# Altium schematic sheet benchtopv2.SchDoc
size A; SheetNumber: 2; SheetTotal: 2
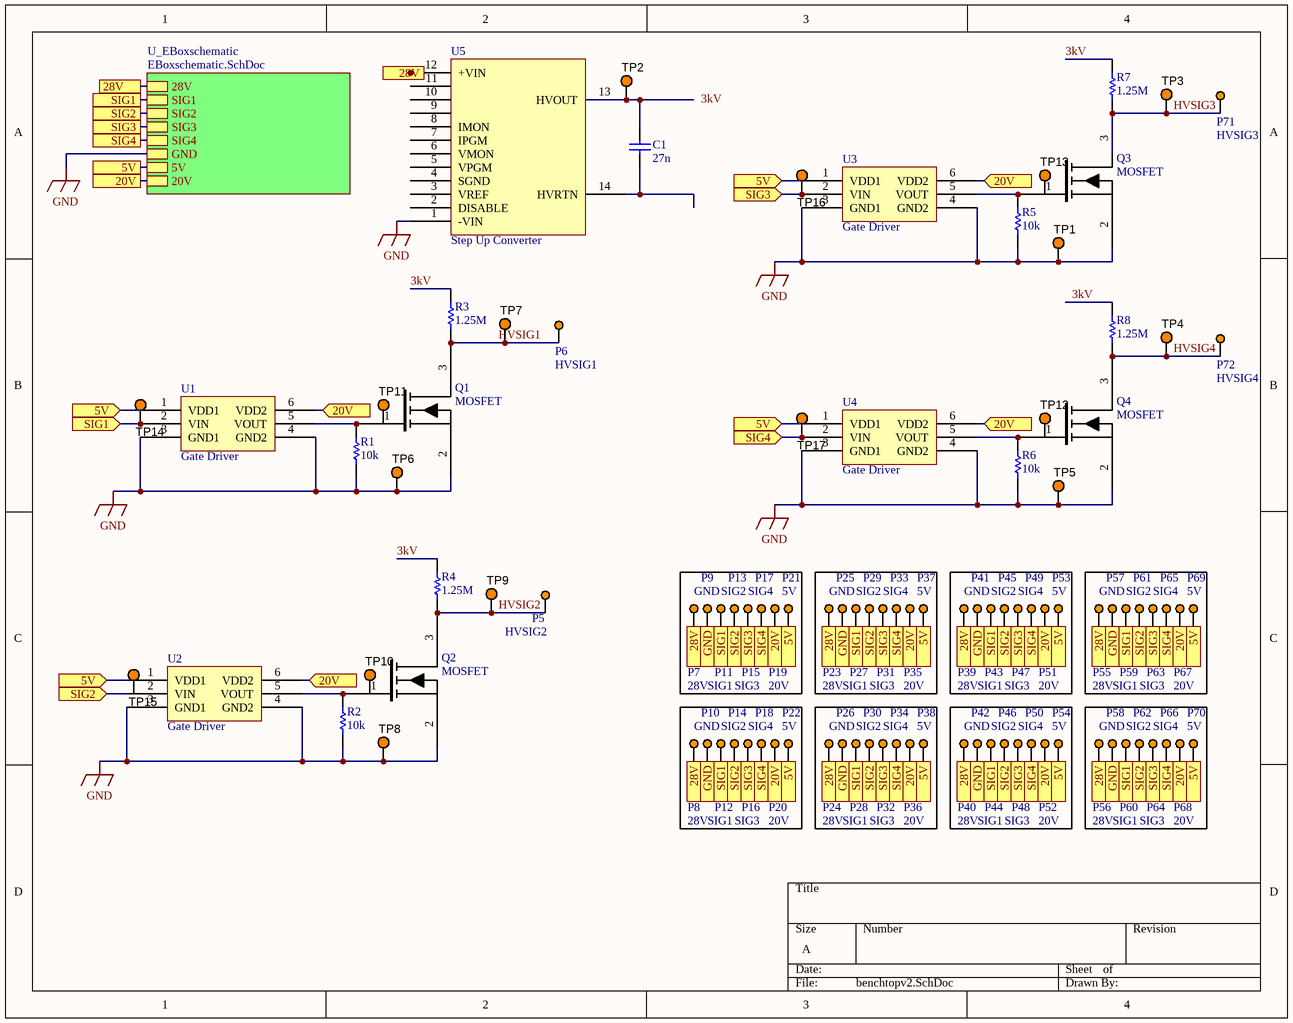
[diagram p0: benchtopv2.SchDoc]

## Parts
C1  27n  [HV Capacitor]
P5  HVSIG2  [Via]
P6  HVSIG1  [Via]
P7  28V  [Via]
P8  28V  [Via]
P9  GND  [Via]
P10  GND  [Via]
P11  SIG1  [Via]
P12  SIG1  [Via]
P13  SIG2  [Via]
P14  SIG2  [Via]
P15  SIG3  [Via]
P16  SIG3  [Via]
P17  SIG4  [Via]
P18  SIG4  [Via]
P19  20V  [Via]
P20  20V  [Via]
P21  5V  [Via]
P22  5V  [Via]
P23  28V  [Via]
P24  28V  [Via]
P25  GND  [Via]
P26  GND  [Via]
P27  SIG1  [Via]
P28  SIG1  [Via]
P29  SIG2  [Via]
P30  SIG2  [Via]
P31  SIG3  [Via]
P32  SIG3  [Via]
P33  SIG4  [Via]
P34  SIG4  [Via]
P35  20V  [Via]
P36  20V  [Via]
P37  5V  [Via]
P38  5V  [Via]
P39  28V  [Via]
P40  28V  [Via]
P41  GND  [Via]
P42  GND  [Via]
P43  SIG1  [Via]
P44  SIG1  [Via]
P45  SIG2  [Via]
P46  SIG2  [Via]
P47  SIG3  [Via]
P48  SIG3  [Via]
P49  SIG4  [Via]
P50  SIG4  [Via]
P51  20V  [Via]
P52  20V  [Via]
P53  5V  [Via]
P54  5V  [Via]
P55  28V  [Via]
P56  28V  [Via]
P57  GND  [Via]
P58  GND  [Via]
P59  SIG1  [Via]
P60  SIG1  [Via]
P61  SIG2  [Via]
P62  SIG2  [Via]
P63  SIG3  [Via]
P64  SIG3  [Via]
P65  SIG4  [Via]
P66  SIG4  [Via]
P67  20V  [Via]
P68  20V  [Via]
P69  5V  [Via]
P70  5V  [Via]
P71  HVSIG3  [Via]
P72  HVSIG4  [Via]
Q1  MOSFET  [MOSFET]
Q2  MOSFET  [MOSFET]
Q3  MOSFET  [MOSFET]
Q4  MOSFET  [MOSFET]
R1  10k  [LV Resistor]
R2  10k  [LV Resistor]
R3  1.25M  [HV resistor]
R4  1.25M  [HV resistor]
R5  10k  [LV Resistor]
R6  10k  [LV Resistor]
R7  1.25M  [HV resistor]
R8  1.25M  [HV resistor]
TP1  5003  [KSTN-5003]  (value not drawn)
TP2  5003  [KSTN-5003]  (value not drawn)
TP3  5003  [KSTN-5003]  (value not drawn)
TP4  5003  [KSTN-5003]  (value not drawn)
TP5  5003  [KSTN-5003]  (value not drawn)
TP6  5003  [KSTN-5003]  (value not drawn)
TP7  5003  [KSTN-5003]  (value not drawn)
TP8  5003  [KSTN-5003]  (value not drawn)
TP9  5003  [KSTN-5003]  (value not drawn)
TP10  5003  [KSTN-5003]  (value not drawn)
TP11  5003  [KSTN-5003]  (value not drawn)
TP12  5003  [KSTN-5003]  (value not drawn)
TP13  5003  [KSTN-5003]  (value not drawn)
TP14  5003  [KSTN-5003]  (value not drawn)
TP15  5003  [KSTN-5003]  (value not drawn)
TP16  5003  [KSTN-5003]  (value not drawn)
TP17  5003  [KSTN-5003]  (value not drawn)
U1  Gate Driver  [Gate Driver]
U2  Gate Driver  [Gate Driver]
U3  Gate Driver  [Gate Driver]
U4  Gate Driver  [Gate Driver]
U5  Step Up Converter  [Step Up Converter]

## Sub-sheets
U_EBoxschematic = EBoxschematic.SchDoc: 28V, SIG1, SIG2, SIG3, SIG4, GND, 5V, 20V

## Ports
5V, 5V (in), 20V, 20V (in), 28V, GND, SIG1, SIG1 (in), SIG2, SIG2 (in), SIG3, SIG3 (in), SIG4, SIG4 (in)

## Nets
GND: Q1.2(S) Q2.2(S) Q3.2(S) Q4.2(S) R1.1 R2.1 R5.1 R6.1 TP1.1 TP5.1 TP6.1 TP8.1 U1.3(GND1) U1.4(GND2) U2.3(GND1) U2.4(GND2) U3.3(GND1) U3.4(GND2) U4.3(GND1) U4.4(GND2) U5.1(-VIN) ; sheet U_EBoxschematic/GND
3kV: R3.1 R4.1 R7.1 R8.1
5V: U1.1(VDD1) U2.1(VDD1) U3.1(VDD1) U4.1(VDD1) ; port 5V, sheet U_EBoxschematic/5V
20V: U1.6(VDD2) U2.6(VDD2) U3.6(VDD2) U4.6(VDD2) ; port 20V, sheet U_EBoxschematic/20V
28V: port 28V, sheet U_EBoxschematic/28V
HVSIG1: Q1.3(D) R3.2 TP7.1
HVSIG2: Q2.3(D) R4.2 TP9.1
HVSIG3: Q3.3(D) R7.2 TP3.1
HVSIG4: Q4.3(D) R8.2 TP4.1
SIG1: TP14.1 U1.2(VIN) ; port SIG1, sheet U_EBoxschematic/SIG1
SIG2: U2.2(VIN) ; port SIG2, sheet U_EBoxschematic/SIG2
SIG3: TP16.1 U3.2(VIN) ; port SIG3, sheet U_EBoxschematic/SIG3
SIG4: TP17.1 U4.2(VIN) ; port SIG4, sheet U_EBoxschematic/SIG4
NetC1_1: C1.1 U5.14(HVRTN)
NetC1_2: C1.2 TP2.1 U5.13(HVOUT)
NetQ1_1: Q1.1(G) R1.2 U1.5(VOUT)
NetQ2_1: Q2.1(G) R2.2 U2.5(VOUT)
NetQ3_1: Q3.1(G) R5.2 U3.5(VOUT)
NetQ4_1: Q4.1(G) R6.2 U4.5(VOUT)

Not connected (* = marked no-connect by the designer): P5 1; P6 1; P7 1; P8 1; P9 1; P10 1; P11 1; P12 1; P13 1; P14 1; P15 1; P16 1; P17 1; P18 1; P19 1; P20 1; P21 1; P22 1; P23 1; P24 1; P25 1; P26 1; P27 1; P28 1; P29 1; P30 1; P31 1; P32 1; P33 1; P34 1; P35 1; P36 1; P37 1; P38 1; P39 1; P40 1; P41 1; P42 1; P43 1; P44 1; P45 1; P46 1; P47 1; P48 1; P49 1; P50 1; P51 1; P52 1; P53 1; P54 1; P55 1; P56 1; P57 1; P58 1; P59 1; P60 1; P61 1; P62 1; P63 1; P64 1; P65 1; P66 1; P67 1; P68 1; P69 1; P70 1; P71 1; P72 1; TP10 1; TP11 1; TP12 1; TP13 1; TP15 1; U5 2(DISABLE) 3(VREF) 4(SGND) 5(VPGM) 6(VMON) 7(IPGM) 8(IMON) 9 10 11 12(+VIN)

## Notes on the sheet
- Labels drawn without touching a wire or pin: 3kV

## Library data of the parts
C1 = Capacitor
P5-P72 = Output Point: Thru hole via
Q1-Q4 = MOSFET: IXTL2N4X0
R1-R8 = Resistor
TP1-TP17 = CMP-002-00037-2: Test Point, Orange, Height 4.6 mm, Tail Length 3 mm, 1-Pin THD, RoHS; Manufacturer: Keystone; Colour: Orange; Packaging: Bulk; Package Description: 1-Pin Through Hole Device, Dia 2.54 mm; Pins: 1; Package Reference: 5003; Datasheet Version: Jun-15; Case/Package: 5003; Mounting Technology: TH; Connector Type: TestPoint; Diameter: 2.54mm; Contact Material: Bronze; Datasheet URL: http://keyelco.com/userAssets/file/M65p56.pdf; Manufacturer URL: http://www.keyelco.com/; Package Quantity: 10; Contact Plating: Tin; RoHS Compliant: True
U1-U4 = Gate Driver: ADuM4120
U5 = Step Up Converter: HRL30